# Altium schematic sheet SNES_DRONE_MCU.SchDoc
size A4
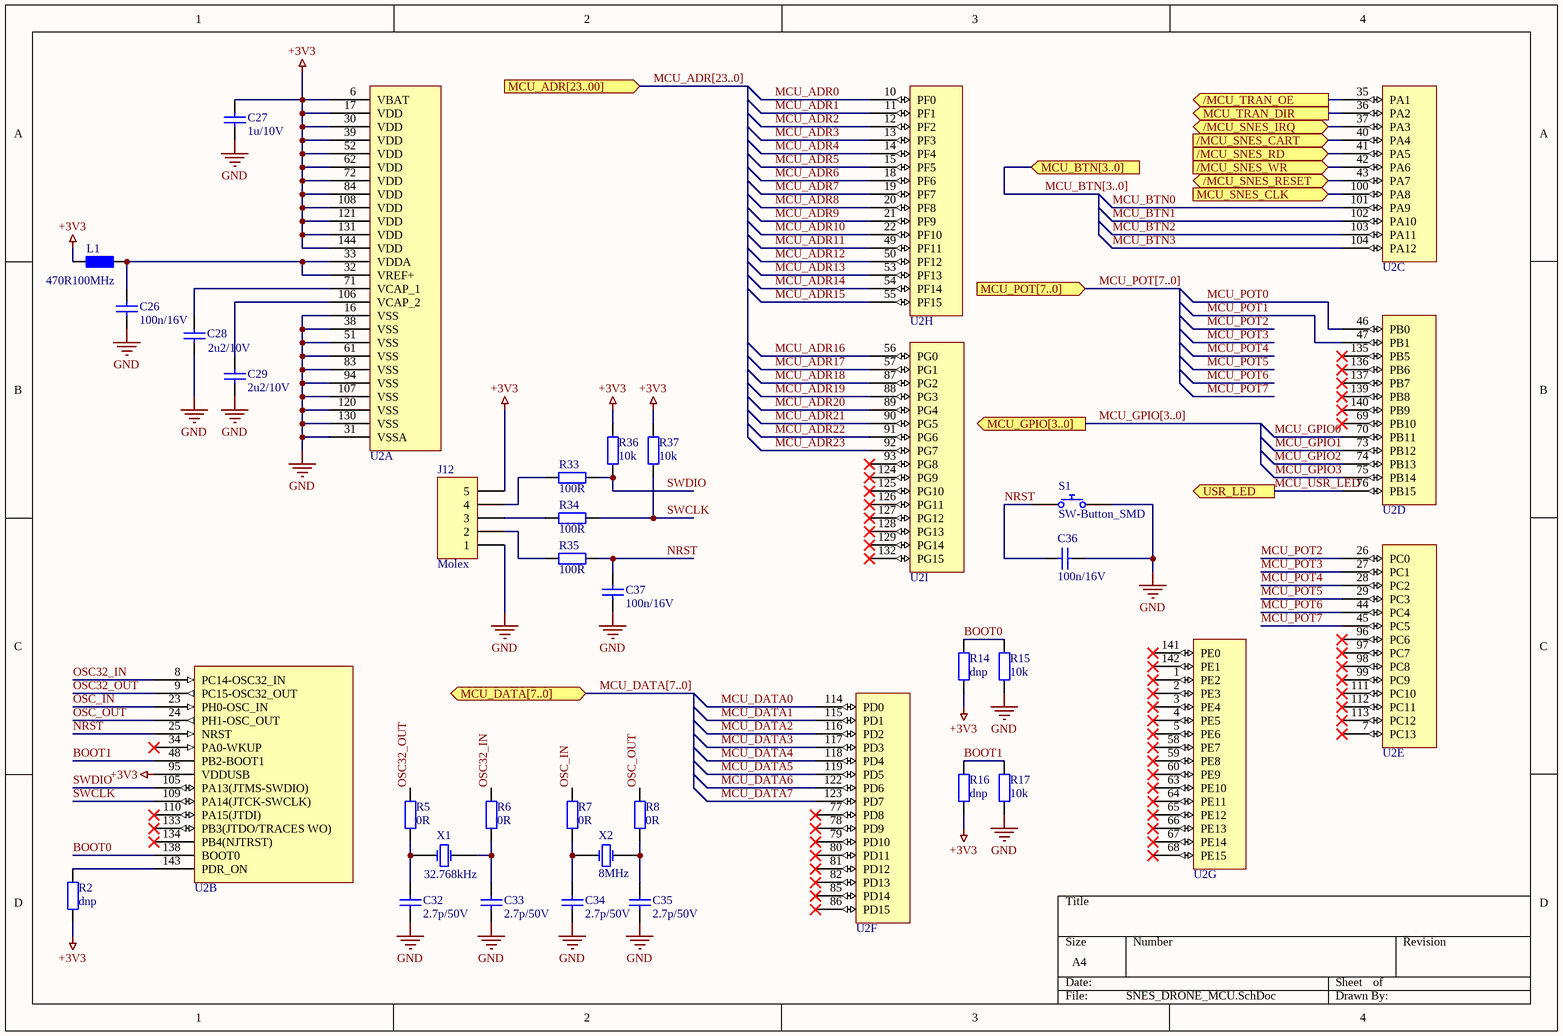
[diagram p0: SNES_DRONE_MCU.SchDoc]

## Parts
C26  100n/16V  [0402_RES]
C27  1u/10V  [0603_RES]
C28  2u2/10V  [0603_RES]
C29  2u2/10V  [0603_RES]
C32  2.7p/50V  [0402_RES]
C33  2.7p/50V  [0402_RES]
C34  2.7p/50V  [0402_RES]
C35  2.7p/50V  [0402_RES]
C36  100n/16V  [0402_RES]
C37  100n/16V  [0402_RES]
J12  Manufacturer 1: Molex  [MOLEX_22-27-2051]  (hidden comment: MOLEX_22-27-2051)
L1  470R100MHz  [0603_RES]
R2  DNP  [0603_DNP]  (no BOM)
R5  0R  [0603_RES]
R6  0R  [0603_RES]
R7  0R  [0603_RES]
R8  0R  [0603_RES]
R14  DNP  [0603_DNP]  (no BOM)
R15  value 10k  [0603_RES]  (hidden comment: 10kOhm 100mW)
R16  DNP  [0603_DNP]  (no BOM)
R17  value 10k  [0603_RES]  (hidden comment: 10kOhm 100mW)
R33  value 100R  [0603_RES]  (hidden comment: 100Ohm 100mW)
R34  value 100R  [0603_RES]  (hidden comment: 100Ohm 100mW)
R35  value 100R  [0603_RES]  (hidden comment: 100Ohm 100mW)
R36  value 10k  [0603_RES]  (hidden comment: 10kOhm 100mW)
R37  value 10k  [0603_RES]  (hidden comment: 10kOhm 100mW)
S1  SW-Button_SMD  [SKQGAFE010]
U2  STM32F446ZE  [LQFP144_SMALL_PADS]  (value not drawn)  (parts A,B,C,D,E,F,G,H,I of 9)
X1  32.768kHz  [XTAL_32768khz]
X2  8MHz  [XTAL_8MHZ]

## Ports
/MCU_SNES_CART (in), /MCU_SNES_IRQ (bidir), /MCU_SNES_RD (in), /MCU_SNES_RESET (bidir), /MCU_SNES_WR (in), /MCU_TRAN_OE (out), MCU_ADR[23..00] (in), MCU_BTN[3..0] (in), MCU_DATA[7..0] (bidir), MCU_GPIO[3..0] (out), MCU_POT[7..0] (in), MCU_SNES_CLK (in), MCU_TRAN_DIR (out), USR_LED (out)

## Nets
+3V3: C27.2 J12.5 L1.1 R2.1 R14.1 R16.1 R36.2 R37.2 U2.6(VBAT) U2.17(VDD) U2.30(VDD) U2.39(VDD) U2.52(VDD) U2.62(VDD) U2.72(VDD) U2.84(VDD) U2.95(VDDUSB) U2.108(VDD) U2.121(VDD) U2.131(VDD) U2.144(VDD)
GND: C26.1 C27.1 C28.1 C29.1 C32.1 C33.1 C34.1 C35.1 C36.2 C37.1 J12.1 R15.1 R17.1 S1.3 U2.16(VSS) U2.31(VSSA) U2.38(VSS) U2.51(VSS) U2.61(VSS) U2.83(VSS) U2.94(VSS) U2.107(VSS) U2.120(VSS) U2.130(VSS)
/MCU_SNES_CART: U2.40(PA4) ; port /MCU_SNES_CART
/MCU_SNES_IRQ: U2.37(PA3) ; port /MCU_SNES_IRQ
/MCU_SNES_RD: U2.41(PA5) ; port /MCU_SNES_RD
/MCU_SNES_RESET: U2.43(PA7) ; port /MCU_SNES_RESET
/MCU_SNES_WR: U2.42(PA6) ; port /MCU_SNES_WR
/MCU_TRAN_OE: U2.35(PA1) ; port /MCU_TRAN_OE
BOOT0: R14.2 R15.2 U2.138(BOOT0)
BOOT1: R16.2 R17.2 U2.48(PB2-BOOT1)
MCU_ADR0: U2.10(PF0)
MCU_ADR1: U2.11(PF1)
MCU_ADR2: U2.12(PF2)
MCU_ADR3: U2.13(PF3)
MCU_ADR4: U2.14(PF4)
MCU_ADR5: U2.15(PF5)
MCU_ADR6: U2.18(PF6)
MCU_ADR7: U2.19(PF7)
MCU_ADR8: U2.20(PF8)
MCU_ADR9: U2.21(PF9)
MCU_ADR10: U2.22(PF10)
MCU_ADR11: U2.49(PF11)
MCU_ADR12: U2.50(PF12)
MCU_ADR13: U2.53(PF13)
MCU_ADR14: U2.54(PF14)
MCU_ADR15: U2.55(PF15)
MCU_ADR16: U2.56(PG0)
MCU_ADR17: U2.57(PG1)
MCU_ADR18: U2.87(PG2)
MCU_ADR19: U2.88(PG3)
MCU_ADR20: U2.89(PG4)
MCU_ADR21: U2.90(PG5)
MCU_ADR22: U2.91(PG6)
MCU_ADR23: U2.92(PG7)
MCU_BTN0: U2.101(PA9)
MCU_BTN1: U2.102(PA10)
MCU_BTN2: U2.103(PA11)
MCU_BTN3: U2.104(PA12)
MCU_DATA0: U2.114(PD0)
MCU_DATA1: U2.115(PD1)
MCU_DATA2: U2.116(PD2)
MCU_DATA3: U2.117(PD3)
MCU_DATA4: U2.118(PD4)
MCU_DATA5: U2.119(PD5)
MCU_DATA6: U2.122(PD6)
MCU_DATA7: U2.123(PD7)
MCU_GPIO0: U2.70(PB11)
MCU_GPIO1: U2.73(PB12)
MCU_GPIO2: U2.74(PB13)
MCU_GPIO3: U2.75(PB14)
MCU_POT0: U2.46(PB0)
MCU_POT1: U2.47(PB1)
MCU_POT2: U2.26(PC0)
MCU_POT3: U2.27(PC1)
MCU_POT4: U2.28(PC2)
MCU_POT5: U2.29(PC3)
MCU_POT6: U2.44(PC4)
MCU_POT7: U2.45(PC5)
MCU_SNES_CLK: U2.100(PA8) ; port MCU_SNES_CLK
MCU_TRAN_DIR: U2.36(PA2) ; port MCU_TRAN_DIR
MCU_USR_LED: U2.76(PB15) ; port USR_LED
NRST: C36.1 C37.2 R35.2 S1.1 U2.25(NRST)
OSC32_IN: R6.2 U2.8(PC14-OSC32_IN)
OSC32_OUT: R5.2 U2.9(PC15-OSC32_OUT)
OSC_IN: R7.2 U2.23(PH0-OSC_IN)
OSC_OUT: R8.2 U2.24(PH1-OSC_OUT)
SWCLK: R34.2 R37.1 U2.109(PA14(JTCK-SWCLK))
SWDIO: R33.2 R36.1 U2.105(PA13(JTMS-SWDIO))
NetC26_2: C26.2 L1.2 U2.32(VREF+) U2.33(VDDA)
NetC28_2: C28.2 U2.71(VCAP_1)
NetC29_2: C29.2 U2.106(VCAP_2)
NetC32_2: C32.2 R5.1 X1.1
NetC33_2: C33.2 R6.1 X1.2
NetC34_2: C34.2 R7.1 X2.1
NetC35_2: C35.2 R8.1 X2.2
NetJ12_2: J12.2 R35.1
NetJ12_3: J12.3 R34.1
NetJ12_4: J12.4 R33.1
NetR2_2: R2.2 U2.143(PDR_ON)

Not connected (* = marked no-connect by the designer): U2 1(PE2)* 2(PE3)* 3(PE4)* 4(PE5)* 5(PE6)* 7(PC13)* 34(PA0-WKUP)* 58(PE7)* 59(PE8)* 60(PE9)* 63(PE10)* 64(PE11)* 65(PE12)* 66(PE13)* 67(PE14)* 68(PE15)* 69(PB10)* 77(PD8)* 78(PD9)* 79(PD10)* 80(PD11)* 81(PD12)* 82(PD13)* 85(PD14)* 86(PD15)* 93(PG8)* 96(PC6)* 97(PC7)* 98(PC8)* 99(PC9)* 110(PA15(JTDI))* 111(PC10)* 112(PC11)* 113(PC12)* 124(PG9)* 125(PG10)* 126(PG11)* 127(PG12)* 128(PG13)* 129(PG14)* 132(PG15)* 133(PB3(JTDO/TRACES_WO))* 134(PB4(NJTRST))* 135(PB5)* 136(PB6)* 137(PB7)* 139(PB8)* 140(PB9)* 141(PE0)* 142(PE1)*

## Buses and harness runs
bus MCU_ADR[23..0] = port MCU_ADR[23..00]
bus MCU_BTN[3..0] = port MCU_BTN[3..0]
bus MCU_DATA[7..0] = port MCU_DATA[7..0]
bus MCU_GPIO[3..0] = port MCU_GPIO[3..0]
bus MCU_POT[7..0] = port MCU_POT[7..0]

## Library data of the parts
C26 C36 C37 = Cap_100n_0402: Keramikvielschichtkondensator, SMD, 0.1 µF, 16 V, 0402 [Metrisch 1005], ± 10%, X5R, Baureihe MC; Manufacturer Part Number 1: MC0402X104K160CT; Manufacturer 1: MULTICOMP; farnell number: 1759388; datasheet: http://www.farnell.com/datasheets/2046096.pdf?_ga=2.184862249.1080119096.1514547302-1693477411.1514385574; Supplier Unit Price 1: 0,0226; Supplier Order Qty 1: 10; ComponentLink1Description: datasheet; ComponentLink1URL: http://www.farnell.com/datasheets/1901289.pdf?_ga=2.126104776.453785206.1540794792-1293375253.1539206166; ComponentLink2Description: farnell; ComponentLink2URL: https://at.farnell.com/multicomp/mc0402x104k160ct/kondensator-0-1-f-16v-10-x5r-0402/dp/1759388?st=1%C2%B5F%20SMD; Supplier 1: Farnell; Supplier Part Number 1: 1760121; Value: 100n/16V
C27 = Cap_1u_0603: Keramikvielschichtkondensator, SMD, 1 µF, 10 V, 0603 [Metrisch 1608], ± 20%, X5R, WCAP-CSGP Series; Manufacturer 1: WURTH ELEKTRONIK; Manufacturer Part Number 1: 885012106010; farnell number: 1166020; datasheet: http://www.farnell.com/datasheets/2046096.pdf?_ga=2.184862249.1080119096.1514547302-1693477411.1514385574; Supplier Unit Price 1: 0,0826; Supplier Order Qty 1: 10; ComponentLink1Description: datasheet; ComponentLink1URL: http://www.farnell.com/datasheets/2031757.pdf?_ga=2.58341487.453785206.1540794792-1293375253.1539206166; ComponentLink2Description: farnell; ComponentLink2URL: https://at.farnell.com/wurth-elektronik/885012106010/kondensator-1-f-10v-20-x5r-0603/dp/2533941?st=1%C2%B5F%20SMD; Supplier 1: Farnell; Supplier Part Number 1: 2533941; Value: 1u/10V
C28 C29 = Cap_2u2_0603: C1608X7R1A225K080AC -  Keramikvielschichtkondensator, SMD, 2.2 µF, 10 V, 0603 [Metrisch 1608], ± 10%, X7R, Baureihe C; Manufacturer 1: TDK; farnell number: 2346896; Supplier Unit Price 1: 0,177; Supplier Order Qty 1: 10; ComponentLink1Description: datasheet; ComponentLink1URL: http://www.farnell.com/datasheets/2291921.pdf?_ga=2.136060017.197329085.1542397831-1931041576.1541506444; ComponentLink2Description: farnell; ComponentLink2URL: https://at.farnell.com/tdk/c1608x7r1a225k080ac/kondensator-2-2-f-10v-10-x7r-0603/dp/2346896; Supplier 1: Farnell; Supplier Part Number 1: 2354341; Manufacturer Part Number 1: C1608X7R1A225K080AC; Value: 2u2/10V
C32-C35 = Cap_2p7_0402: Keramikvielschichtkondensator, SMD, 2.7 pF, 50 V, 0402 [Metrisch 1005], ± 0.25pF, C0G / NP0; Manufacturer 1: KEMET; Manufacturer Part Number 1: C0402C279C5GACTU; farnell number: 1865415; datasheet: http://www.farnell.com/datasheets/2046096.pdf?_ga=2.184862249.1080119096.1514547302-1693477411.1514385574; Supplier Unit Price 1: 0,0482; Supplier Order Qty 1: 10; ComponentLink1Description: datasheet; ComponentLink1URL: http://www.farnell.com/datasheets/2315001.pdf?_ga=2.24763903.453785206.1540794792-1293375253.1539206166; ComponentLink2Description: farnell; ComponentLink2URL: https://at.farnell.com/kemet/c0402c279c5gactu/kondensator-2-7pf-50v-c0g-np0/dp/1865415; Supplier 1: Farnell; Supplier Part Number 1: 8771367; Value: 2.7p/50V
J12 = MOLEX_22-27-2051: 5 pin molex connector; farnell number: 9731679; Supplier Unit Price 1: 0,271; datasheet: http://www.farnell.com/datasheets/2266141.pdf?_ga=2.175065506.1080119096.1514547302-1693477411.1514385574; Manufacturer Part Number 1: 22-27-2051; Supplier 1: Farnell; ComponentLink1Description: datasheet; ComponentLink1URL: http://www.farnell.com/datasheets/1861453.pdf?_ga=2.126244552.471268527.1516457893-947204359.1516457893; ComponentLink2Description: farnell; ComponentLink2URL: http://at.farnell.com/molex/22-27-2051/header-square-pin-0-1zoll-5way/dp/9731679?ost=9731679&ddkey=http%3Ade-AT%2FElement14_Austria%2Fsearch; Supplier Part Number 1: 9731679; Supplier Order Qty 1: 10; Value: *
L1 = FER_0603_470R: BLM18PG471SN1D -  Ferritperle, 0603 [Metrisch 1608], 470 ohm, 1 A, Baureihe BLM18P, 0.2 ohm, ± 25%; Manufacturer 1: MURATA; Suppler Unit Price 1: 0,0562; Supplier Order Qty 1: 10; Value: 470R100MHz; ComponentLink1Description: datasheet; ComponentLink1URL: http://www.farnell.com/datasheets/1740433.pdf?_ga=2.107600706.197329085.1542397831-1931041576.1541506444; ComponentLink2Description: farnell; ComponentLink2URL: https://at.farnell.com/murata/blm18pg471sn1d/ferrite-perle-0603-bauform-470ohm/dp/1515745?MER=bn_browse_1TP_MostPopular_1; Supplier 1: Farnell; Manufacturer Part Number 1: BLM18PG471SN1D; Supplier Part Number 1: 1515745RL
R2 R14 R16 = RES_DNP: Value: dnp
R5-R8 = RES_0603_0R: YAGEO 0R; Manufacturer Part Number 1: RC0603FR-070RL; Suppler Unit Price 1: 0,053; Supplier Order Qty 1: 10; Supplier 1: Farnell; ComponentLink1Description: datasheet; ComponentLink1URL: http://www.farnell.com/datasheets/1868787.pdf?_ga=2.169539809.197329085.1542397831-1931041576.1541506444; ComponentLink2Description: farnell; ComponentLink2URL: https://at.farnell.com/yageo/rc0603fr-070rl/dickschichtwiderstand-0r0-1-0/dp/2693558; Supplier Part Number 1: 2309106; Manufacturer 1: YAGEO; Value: 0R
R15 R17 R36 R37 = RES_0603_10k_100mW: YAGEO 10kOhm 100mW ± 1%; Manufacturer Part Number 1: RC0603JR-0710KL; Suppler Unit Price 1: 0,0195; Supplier Order Qty 1: 10; Supplier 1: Farnell; ComponentLink1Description: datasheet; ComponentLink1URL: http://www.farnell.com/datasheets/2167052.pdf?_ga=2.236107713.197329085.1542397831-1931041576.1541506444; ComponentLink2Description: farnell; ComponentLink2URL: https://at.farnell.com/yageo/rc0603jr-0710kl/dickschichtwiderstand-10k-5-0/dp/9233504; Supplier Part Number 1: 9233504RL; Manufacturer 1: YAGEO
R33-R35 = RES_0603_100_100mW: PANASONIC ELECTRONIC COMPONENTS 100Ohm 100mW ± 1%; Manufacturer Part Number 1: ERJ3EKF1000V; Suppler Unit Price 1: 0,053; Supplier Order Qty 1: 10; Supplier 1: Farnell; ComponentLink1Description: datasheet; ComponentLink1URL: http://www.farnell.com/datasheets/1911175.pdf?_ga=2.135975793.197329085.1542397831-1931041576.1541506444; ComponentLink2Description: farnell; ComponentLink2URL: https://at.farnell.com/panasonic-electronic-components/erj3ekf1000v/dickschichtwiderstand-100r-1-0/dp/2303059; Supplier Part Number 1: 2304564; Manufacturer 1: PANASONIC ELECTRONIC COMPONENTS
S1 = SW-Button_SMD: ALPS SMD Push Button; Supplier 1: Farnell; ComponentLink1Description: datasheet; ComponentLink1URL: http://www.farnell.com/datasheets/1582326.pdf?_ga=2.174774114.197329085.1542397831-1931041576.1541506444; ComponentLink2Description: farnell; ComponentLink2URL: https://at.farnell.com/alps/skqgafe010/taster-smd-0-98n-5-2x5-2mm/dp/2056843; Supplier Part Number 1: 2056843RL; Manufacturer 1: ALPS; Manufacturer Part Number 1: SKQGAFE010; Supplier Order Qty 1: 10; Supplier Unit Price 1: 0,544
U2 = STM32F446ZE: ARM Cortex-M4, 180MHz, 512KB, 128KB; Manufacturer 1: ST; Manufacturer Part Number 1: STM32F446ZET6; farnell number: 2535607; datasheet: http://www.farnell.com/datasheets/1913545.pdf?_ga=2.172501667.1080119096.1514547302-1693477411.1514385574; Supplier Order Qty 1: 5; Value: *; Supplier Unit Price 1: 0,914; ComponentLink1Description: datasheet; ComponentLink1URL: http://www.farnell.com/datasheets/2309063.pdf?_ga=2.211445013.1861125961.1540492103-1293375253.1539206166; ComponentLink2Description: farnell; ComponentLink2URL: https://at.farnell.com/stmicroelectronics/stm32f446zet6/mcu-32bit-cortex-m4-180mhz-lqfp/dp/2488317?ost=STM32F446ZET6&scope=partnumberlookahead&searchref=searchlookahead&krypto=c3kNjvKBdgDFfKBoyKQ7uBR8CcHN8OihP%2FFRmWmhnjqGKzkXdgHVEsC0KjPeQc4yhoNBdiRdvz1UNXoeZ%2Bj9Wls9Ou9qhpytzyrLSPkMbSzMdEC257%2FL94QRGGS5HHvaMslZO2Q7%2B6CdbVDy5GqmpX33KX1yJm4tp9dxxMEe1JMGz1J40K%2BG1giSzi911lbsFGEvkm%2B2OaJvWyaxtKR2mAyqWullap%2BAFNEvolJUG1EHPiy5cjnXeImhlfdZhtWBdLgHpejLEui5Q6y5U7L2NYvYUl3K5pituisIIykjMSPPvhjcMk3tWgIKuacRYgN8kxpcHrLkyaDLpzoP5T5NY%2BHR9SwopXidDHX9YI3Yb34Y3YXsCIKK8qKpz0zDmwafzwjYGEhxJbTR8qzPL%2BDUrkSJooKnNUI2RI4wv%2FqyRs36BnDpuxjqxlwlPyG%2BLBMeDOHMBNjHJC4brpI6hfLJj75Ajkn2U7w%2B31NVMZq3xrvyCIT%2B4tTT8Pu%2BR%2FG%2FjvegGvNF1Kbe90ARMvaGPJ5x6rIipkziu%2BsfsHaTJXClEq2NLmS%2FHmvLTHYQS1iCR0rt0zwDZQAJpIRPSuMTGAQvu7iD0LTYC7oHGR4HslyVtrM%3D&ddkey=https%3Ade-AT%2FElement14_Austria%2Fw%2Fsearch; ComponentLink3Description: STM; ComponentLink3URL: https://www.st.com/en/microcontrollers/stm32f446ze.html; Supplier 1: Farnell; Supplier Part Number 1: 2488317
X1 = XTAL_32.768kHz: AB38T-32.768KHZ -  Quarz, 32.768 kHz, Zylinder, radial bedrahtet, 8.2mm x 3.2mm Durchm., 12.5 pF, 20 ppm; Manufacturer 1: ABRACON; Supplier Unit Price 1: 0,167; Supplier Order Qty 1: 1; Value: 32.768kHz; ComponentLink1Description: datasheet; ComponentLink1URL: http://www.farnell.com/datasheets/1883667.pdf?_ga=2.68425681.197329085.1542397831-1931041576.1541506444; ComponentLink2Description: farnell; ComponentLink2URL: https://at.farnell.com/abracon/ab38t-32-768khz/quarz-32-768khz-12-5pf-uhr-a/dp/1611828; Supplier 1: Farnell; Supplier Part Number 1: 1611828; Manufacturer Part Number 1: AB38T-32.768KHZ
X2 = XTAL_8MHz: 9B-8.000MAAJ-B -  Quarz, 8 MHz, Durchsteckmontage, 11.5mm x 5mm, 30 ppm, 18 pF, 30 ppm, Baureihe 9B; Manufacturer 1: TXC; ComponentLink1Description: farnell; ComponentLink1URL: https://at.farnell.com/txc/9b-8-000maaj-b/xtal-8-000mhz-18pf-hc-49s/dp/1842268; ComponentLink2Description: datasheet; ComponentLink2URL: http://www.farnell.com/datasheets/1364712.pdf?_ga=2.75608277.197329085.1542397831-1931041576.1541506444; Supplier 1: Farnell; Supplier Part Number 1: 1842268; Manufacturer Part Number 1: 9B-8.000MAAJ-B; Supplier Unit Price 1: 0,453; Supplier Order Qty 1: 1; Value: 8MHz